# Altium project DIO_RJ45_DIOT.PrjPCB (part 1 of 3)
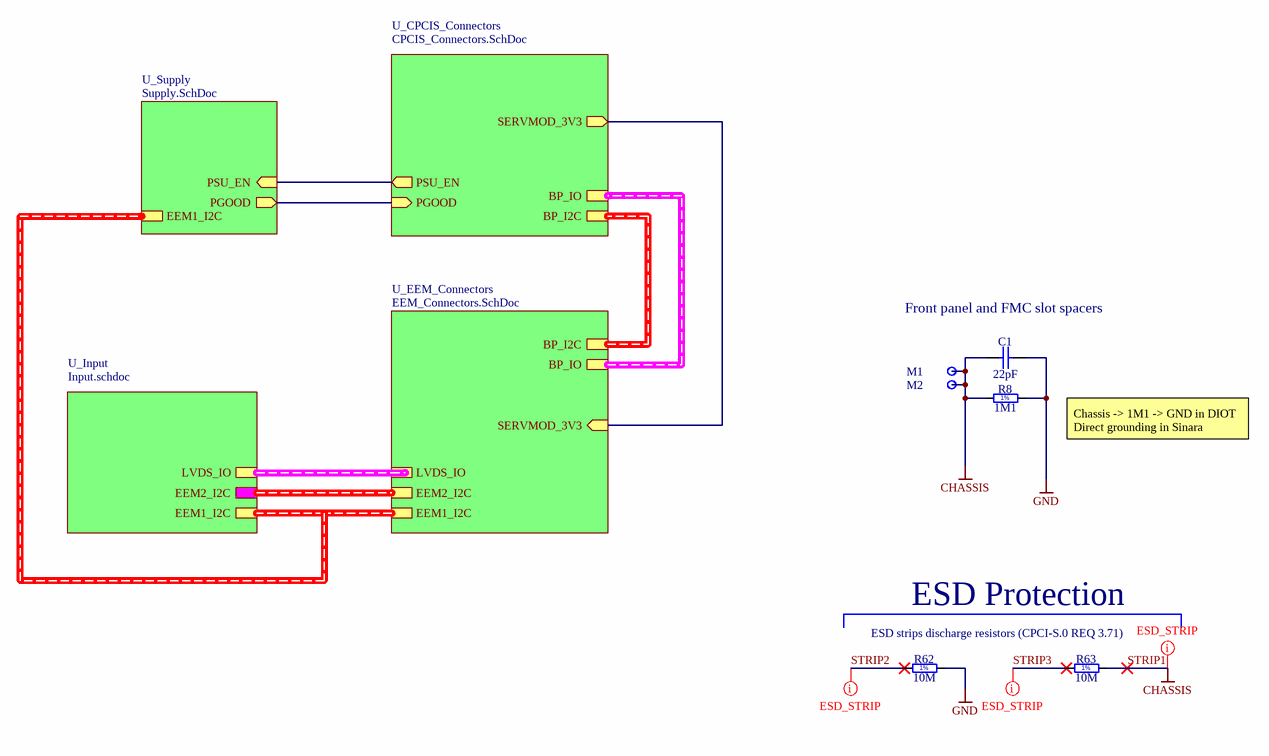
[diagram p0: DIO45_TOP.SchDoc]
Address1: Warsaw Uniwersity of Technology; Address2: Nowowiejska 15/19; Address3: ise@pw.edu.pl; Author: G.K.; CheckedDate: -; CompanyName: WUT; CreateDate: -; Designer: G.K.; DrawnBy: G.K.; ModifiedBy: M.Mroz; Organization: WUT ISE; ProjectName: DIO_RJ45_DIOT; Revision: 1.2; SheetTotal: 6; Title: DIO_RJ45_DIOT
6 sheets, 318 parts. Net scope: hierarchical (ports join the sheet entries above them; power ports are global).
Board file: DIO_RJ45_DIOT.PCBDOC
Sheets:
  DIO45_TOP.SchDoc
    U_CPCIS_Connectors = CPCIS_Connectors.SchDoc
    U_EEM_Connectors = EEM_Connectors.SchDoc
    U_Input = Input.schdoc
      U_LVDS_repeater = LVDS_repeater.SchDoc
      U_LVDS_repeater = LVDS_repeater.SchDoc
      U_LVDS_repeater = LVDS_repeater.SchDoc
      U_LVDS_repeater = LVDS_repeater.SchDoc
      U_LVDS_repeater = LVDS_repeater.SchDoc
      U_LVDS_repeater = LVDS_repeater.SchDoc
      U_LVDS_repeater = LVDS_repeater.SchDoc
      U_LVDS_repeater = LVDS_repeater.SchDoc
      U_LVDS_repeater = LVDS_repeater.SchDoc
      U_LVDS_repeater = LVDS_repeater.SchDoc
      U_LVDS_repeater = LVDS_repeater.SchDoc
      U_LVDS_repeater = LVDS_repeater.SchDoc
      U_LVDS_repeater = LVDS_repeater.SchDoc
      U_LVDS_repeater = LVDS_repeater.SchDoc
      U_LVDS_repeater = LVDS_repeater.SchDoc
      U_LVDS_repeater = LVDS_repeater.SchDoc
    U_Supply = Supply.SchDoc

## Sheet DIO45_TOP.SchDoc: DIO_RJ45_DIOT
size 297 x 209 mm; Revision: 0.1; SheetNumber: 1; SheetTotal: 5; Title2: DIO45_TOP

### Parts
C1  22pF  [CAPC1005X55N]
M1  Plated Hole  [MTG300_600]  (value not drawn)  (no BOM)
M2  Plated Hole  [MTG300_600]  (value not drawn)  (no BOM)
R8  1M1  [RESC2012X60N]
R62  10M  [RESC2113X55N]
R63  10M  [RESC2113X55N]

### Sub-sheets
U_CPCIS_Connectors = CPCIS_Connectors.SchDoc: BP_I2C (harness I2C), SERVMOD_3V3 (out), BP_IO (harness BP_IO), PSU_EN (out), PGOOD (in)
U_EEM_Connectors = EEM_Connectors.SchDoc: EEM1_I2C (harness I2C), EEM2_I2C (harness I2C), LVDS_IO (harness LVDS_IO), BP_IO (harness BP_IO), BP_I2C (harness I2C), SERVMOD_3V3 (in)
U_Input = Input.schdoc: EEM1_I2C (harness I2C), EEM2_I2C (harness I2C), LVDS_IO (harness LVDS_IO)
U_Supply = Supply.SchDoc: PSU_EN (in), PGOOD (out), EEM1_I2C (harness I2C)

### Nets
GND: C1.2 R8.2 R62.2
STRIP1: C1.1 M1.1 M2.1 R8.1 R63.2  [also labelled CHASSIS]
PGOOD: sheet U_CPCIS_Connectors/PGOOD, sheet U_Supply/PGOOD
PSU_EN: sheet U_CPCIS_Connectors/PSU_EN, sheet U_Supply/PSU_EN
SERVMOD_3V3: sheet U_CPCIS_Connectors/SERVMOD_3V3, sheet U_EEM_Connectors/SERVMOD_3V3
STRIP2: R62.1
STRIP3: R63.1

### Buses and harness runs
harness sheet U_CPCIS_Connectors/BP_I2C = sheet U_EEM_Connectors/BP_I2C
harness sheet U_CPCIS_Connectors/BP_IO = sheet U_EEM_Connectors/BP_IO
harness sheet U_EEM_Connectors/EEM1_I2C = sheet U_Input/EEM1_I2C = sheet U_Supply/EEM1_I2C
harness sheet U_EEM_Connectors/EEM2_I2C = sheet U_Input/EEM2_I2C
harness sheet U_EEM_Connectors/LVDS_IO = sheet U_Input/LVDS_IO

### Layout directives
net class ESD_STRIP: STRIP1, STRIP2, STRIP3

### Notes on the sheet
- Front panel and FMC slot spacers
- Chassis -> 1M1 -> GND in DIOT
  Direct grounding in Sinara
- ESD strips discharge resistors (CPCI-S.0 REQ 3.71)
- ESD Protection
- Project/Equipment
- Document
- Designer
- Drawn by
- Check.by
- Copyright WUT ISE 2024.
  This documentation describes Open Hardware and is licensed under the CERN OHL v.2. You may redistribute and modify this documentation under the terms of the CERN OHL v.2. (http://ohwr.org/CERNOHL). This documentation is distributed WITHOUT ANY EXPRESS OR IMPLIED WARRANTY, INCLUDING OF MERCHANTABILITY, SATISFACTORY QUALITY AND FITNESS FOR A PARTICULAR PURPOSE. Please see the CERN OHL v.2 for applicable conditions.
- Contact
- File
- Last Mod.
- Print Date
- Sheet
- Size
- A3
- of
- Rev
- (in symbol R0805_1M1_1%_0.125W_100PPM) 1%
- (in symbol R0805_10M_1%_0.125W_100PPM_VISHAY_CRCW e3) 1%

### Library data of the parts
C1 = CC0402_22PF_50V_5%_C0G: Non-polarised capacitor; Part Description: SMD Multilayer Chip Ceramic Capacitor; Manufacturer: GENERIC; Manufacturer1 Part Number: C0402C220J5GACTU; Voltage: 50V; TC: C0G/NP0; Tolerance: ±5%; Part Number: CC0402_22PF_50V_5%_C0G; Component Kind: Standard; Component Type: Standard; Pin Count: 2; Value: 22pF; Status: Preferred; Manufacturer Part Number: CC0402_22PF_50V_5%_C0G; Case: 0402; Mounted: Yes; Socket: No; SMD: Yes; Manufacturer1 Example: KEMET; Manufacturer1 ComponentHeight: 0.55mm; HelpURL: \\cern.ch\dfs\Applications\Altium\Datasheets\CC0402_C0G_KEMET_(Commercial Grade).pdf; Author: CERN DEM JLC; CreateDate: 2007-12-03; LatestRevisionDate: 2007-12-03; Sense: No
M1 M2 = PLATED_HOLE3.0_PAD6.0: Single Terminal Socket; Part Description: Plated Through Hole: Hole Dia.=3.0mm Pad Dia.=6.0mm; Mounted: No; Table: Pads; Part Number: PLATED_HOLE3.0_PAD6.0; Component Type: Standard (No BOM); Designator: Single Terminal Socket; Library Reference: Single Terminal Socket; Pin Count: 1; Family: Plated Hole; Socket: No; SMD: No; Status: None; ComponentHeight: 0mm; Author: CERN DEM JLC; CreateDate: 26.05.2008; LatestRevisionDate: 26.05.2008; PackageDescription: Plated Through Hole: Hole Dia.=3.0mm Pad Dia.=6.0mm
R8 = R0805_1M1_1%_0.125W_100PPM: Resistor - 1%; Part Description: General Purpose Thick Film Chip Resistor; Manufacturer: GENERIC; Manufacturer1 Part Number: NRC10F1104TRF; PressFit: No; Part Number: R0805_1M1_1%_0.125W_100PPM; Component Kind: Standard; Component Type: Standard; Pin Count: 2; Value: 1M1; Status: Preferred; Manufacturer Part Number: R0805_1M1_1%_0.125W_100PPM; Case: 0805; Mounted: Yes; Sense: No; Socket: No; SMD: Yes; Manufacturer1 Example: NIC COMPONENT; Manufacturer1 ComponentHeight: 0.6mm; HelpURL: \\cern.ch\dfs\Applications\Altium\Datasheets\R0805_NIC_NRC.pdf; Author: CERN DEM JLC; CreateDate: 03/12/2007; LatestRevisionDate: 13/03/2008
R62 R63 = R0805_10M_1%_0.125W_100PPM_VISHAY_CRCW e3: Resistor - 1%; Part Description: 150V, Standard Thick Film Chip Resistor; Manufacturer: VISHAY DALE; Manufacturer Part Number: CRCW080510M0FKEA; Power: 0.125W; TC: ±100ppm/°C; PressFit: No; Part Number: R0805_10M_1%_0.125W_100PPM_VISHAY_CRCW e3; Component Kind: Standard; Component Type: Standard; Pin Count: 2; Value: 10M; Status: None; Tolerance: ±1%; Case: 0805; Mounted: Yes; Sense: No; Socket: No; SMD: Yes; ComponentHeight: 0.5mm; HelpURL: \\cern.ch\dfs\Applications\Altium\Datasheets\R0805_VISHAY_CRCW e3.pdf; Author: CERN DEM BC; CreateDate: 2019-11-12; LatestRevisionDate: 2019-11-12

## Sheet CPCIS_Connectors.SchDoc: DIO_RJ45_DIOT
size 420 x 297 mm; SheetNumber: 3; SPICEModelCacheWWJYHNFZ: <root> / <DocumentId>WWJYHNFZ</DocumentId> / </root>; Title2: CPCIS_Connectors
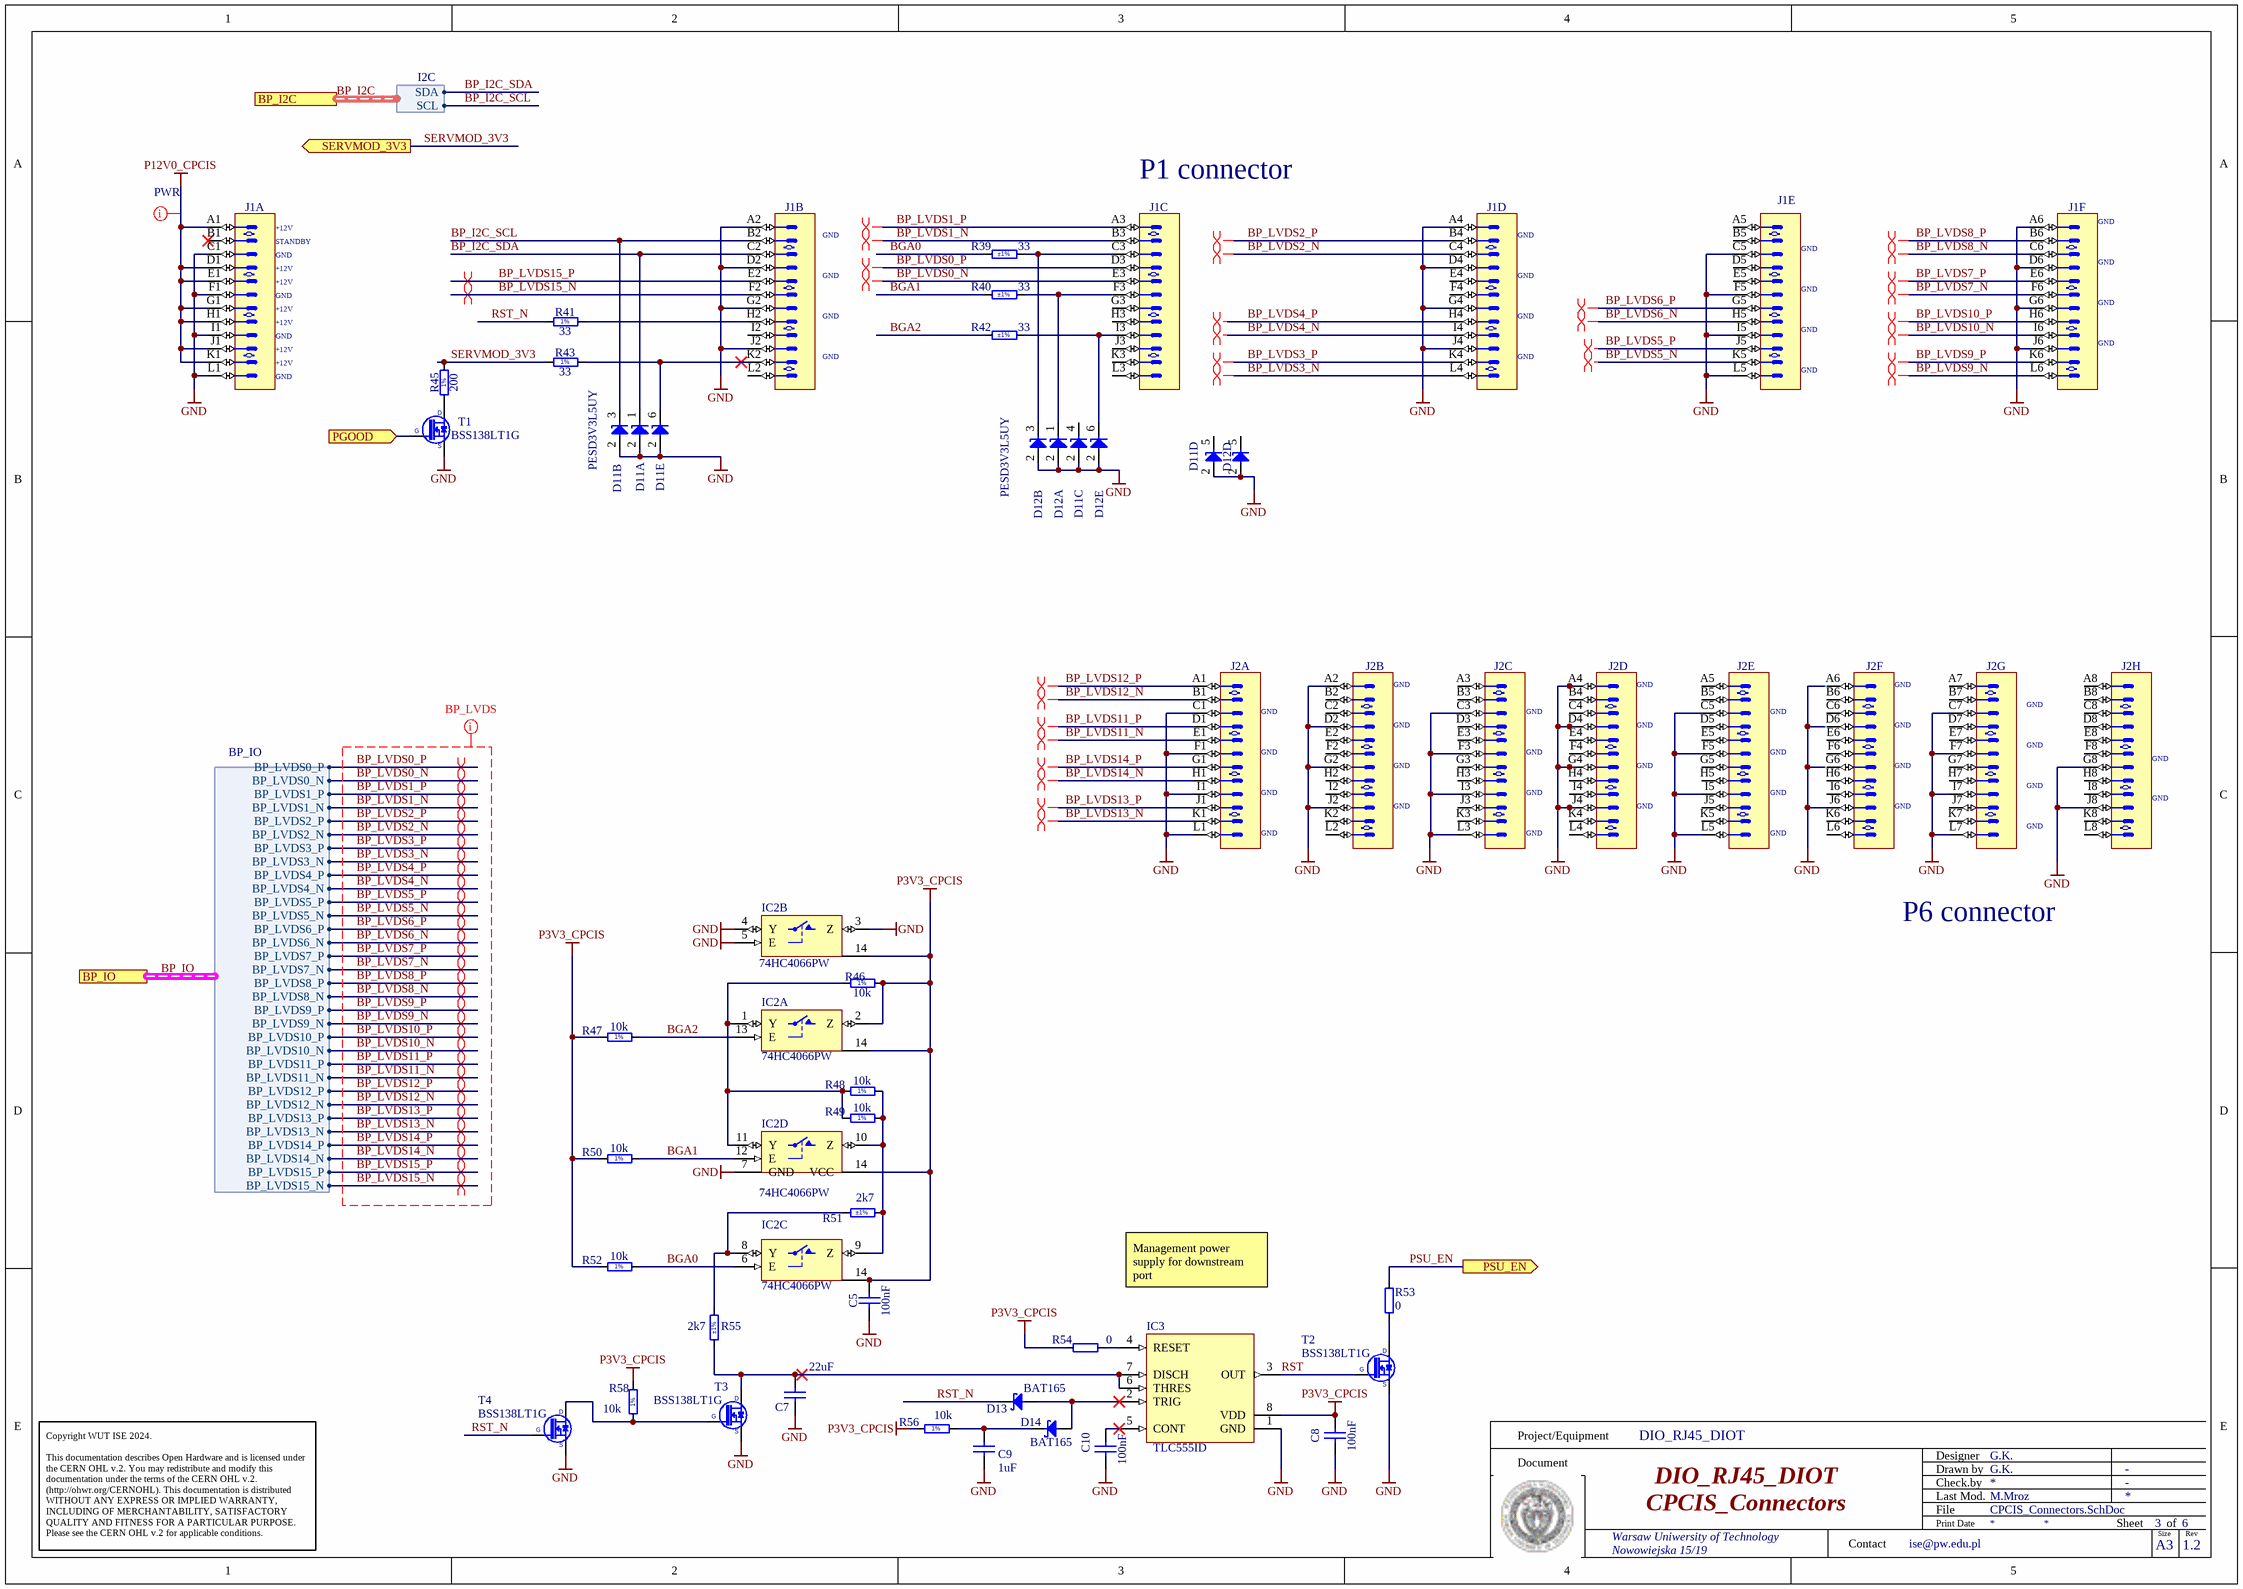
[diagram p1: CPCIS_Connectors.SchDoc]

### Parts
C5  100nF  [CAPC1005X55N]
C7  22uF  [CAPC2012X135N]
C8  100nF  [CAPC1005X55N]
C9  1uF  [CAPC1608X87N]
C10  100nF  [CAPC1005X55N]
D11  PESD3V3L5UY  [SOT65P210X110-6N]  (value not drawn)  (parts A,B,C,D,E of 5)
D12  PESD3V3L5UY  [SOT65P210X110-6N]  (value not drawn)  (parts A,B,D,E of 5)
D13  BAT165  [SOD2512X110N]
D14  BAT165  [SOD2512X110N]
IC2  74HC4066PW  [SOP65P640X110-14N]  (parts A,B,C,D of 4)
IC3  TLC555ID  [SOIC127P600X175-8N]
J1  (no value)  [AMPHENOL_10052825-101LF]  (parts A,B,C,D,E,F of 6)
J2  (no value)  [AMPHENOL_10052838-101LF]  (parts A,B,C,D,E,F,G,H of 8)
R39  33  Tolerance: ±1%  [RESC1608X55N]
R40  33  Tolerance: ±1%  [RESC1608X55N]
R41  33  Tolerance: 1%  [RESC1005X40N]
R42  33  Tolerance: ±1%  [RESC1608X55N]
R43  33  Tolerance: 1%  [RESC1005X40N]
R45  200  [RESC1005X40N]
R46  10k  [RESC1005X40N]
R47  10k  [RESC1005X40N]
R48  10k  [RESC1005X40N]
R49  10k  [RESC1005X40N]
R50  10k  [RESC1005X40N]
R51  2k7  Tolerance: ±1%  [RESC1608X55N]
R52  10k  [RESC1005X40N]
R53  0  [RESC1005X35N]
R54  0  [RESC1005X35N]
R55  2k7  Tolerance: ±1%  [RESC1608X55N]
R56  10k  [RESC1005X40N]
R58  10k  [RESC1005X40N]
T1  BSS138LT1G  [SOT95P240X110-3N]
T2  BSS138LT1G  [SOT95P240X110-3N]
T3  BSS138LT1G  [SOT95P240X110-3N]
T4  BSS138LT1G  [SOT95P240X110-3N]

### Ports
BP_I2C (harness I2C), BP_IO (harness BP_IO), PGOOD (in), PSU_EN (out), SERVMOD_3V3 (out)

### Harnesses
I2C: SDA, SCL
BP_IO: BP_LVDS0_P, BP_LVDS0_N, BP_LVDS1_P, BP_LVDS1_N, BP_LVDS2_P, BP_LVDS2_N, BP_LVDS3_P, BP_LVDS3_N, BP_LVDS4_P, BP_LVDS4_N, BP_LVDS5_P, BP_LVDS5_N, BP_LVDS6_P, BP_LVDS6_N, BP_LVDS7_P, BP_LVDS7_N, BP_LVDS8_P, BP_LVDS8_N, BP_LVDS9_P, BP_LVDS9_N, BP_LVDS10_P, BP_LVDS10_N, BP_LVDS11_P, BP_LVDS11_N, BP_LVDS12_P, BP_LVDS12_N, BP_LVDS13_P, BP_LVDS13_N, BP_LVDS14_P, BP_LVDS14_N, BP_LVDS15_P, BP_LVDS15_N

### Nets
GND: C5.1 C7.1 C8.1 C9.1 C10.1 D11.2(A) D12.2(A) IC2.3(Z) IC2.4(Y) IC2.5(E) IC2.7(GND) IC3.1(GND) J1.A2 J1.A4 J1.A6 J1.C1 J1.C5 J1.D2 J1.D4 J1.D6 J1.F1 J1.F5 J1.G2 J1.G4 J1.G6 J1.I1 J1.I5 J1.J2 J1.J4 J1.J6 J1.L1 J1.L5 J2.A2 J2.A4 J2.C1 J2.C3 J2.C5 J2.C7 J2.D2 J2.D4 J2.F1 J2.F3 J2.F5 J2.F7 J2.G2 J2.G4 J2.G8 J2.I1 J2.I3 J2.I5 J2.I7 J2.J2 J2.J4 J2.J6 J2.J8 J2.L1 J2.L3 J2.L5 J2.L7 T1.2(S) T2.2(S) T3.2(S) T4.2(S)
P3V3_CPCIS: C5.2 C8.2 IC2.2(Z) IC2.14(VCC) IC3.8(VDD) R46.2 R47.1 R50.1 R52.1 R54.2 R56.1 R58.2
P12V0_CPCIS: J1.A1 J1.D1 J1.E1 J1.G1 J1.H1 J1.J1 J1.K1
BGA0: IC2.6(E) R39.2 R52.2
BGA1: IC2.12(E) R40.2 R50.2
BGA2: IC2.13(E) R42.2 R47.2
BP_I2C_SCL: D11.3(C) J1.B2 ; port BP_I2C.SCL  [project net BP_I2C.SCL]
BP_I2C_SDA: D11.1(C) J1.C2 ; port BP_I2C.SDA  [project net BP_I2C.SDA]
BP_LVDS0_N: J1.E3 ; port BP_IO.BP_LVDS0_N  [project net BP_IO.BP_LVDS0_N]
BP_LVDS0_P: J1.D3 ; port BP_IO.BP_LVDS0_P  [project net BP_IO.BP_LVDS0_P]
BP_LVDS1_N: J1.B3 ; port BP_IO.BP_LVDS1_N  [project net BP_IO.BP_LVDS1_N]
BP_LVDS1_P: J1.A3 ; port BP_IO.BP_LVDS1_P  [project net BP_IO.BP_LVDS1_P]
BP_LVDS2_N: J1.C4 ; port BP_IO.BP_LVDS2_N  [project net BP_IO.BP_LVDS2_N]
BP_LVDS2_P: J1.B4 ; port BP_IO.BP_LVDS2_P  [project net BP_IO.BP_LVDS2_P]
BP_LVDS3_N: J1.L4 ; port BP_IO.BP_LVDS3_N  [project net BP_IO.BP_LVDS3_N]
BP_LVDS3_P: J1.K4 ; port BP_IO.BP_LVDS3_P  [project net BP_IO.BP_LVDS3_P]
BP_LVDS4_N: J1.I4 ; port BP_IO.BP_LVDS4_N  [project net BP_IO.BP_LVDS4_N]
BP_LVDS4_P: J1.H4 ; port BP_IO.BP_LVDS4_P  [project net BP_IO.BP_LVDS4_P]
BP_LVDS5_N: J1.K5 ; port BP_IO.BP_LVDS5_N  [project net BP_IO.BP_LVDS5_N]
BP_LVDS5_P: J1.J5 ; port BP_IO.BP_LVDS5_P  [project net BP_IO.BP_LVDS5_P]
BP_LVDS6_N: J1.H5 ; port BP_IO.BP_LVDS6_N  [project net BP_IO.BP_LVDS6_N]
BP_LVDS6_P: J1.G5 ; port BP_IO.BP_LVDS6_P  [project net BP_IO.BP_LVDS6_P]
BP_LVDS7_N: J1.F6 ; port BP_IO.BP_LVDS7_N  [project net BP_IO.BP_LVDS7_N]
BP_LVDS7_P: J1.E6 ; port BP_IO.BP_LVDS7_P  [project net BP_IO.BP_LVDS7_P]
BP_LVDS8_N: J1.C6 ; port BP_IO.BP_LVDS8_N  [project net BP_IO.BP_LVDS8_N]
BP_LVDS8_P: J1.B6 ; port BP_IO.BP_LVDS8_P  [project net BP_IO.BP_LVDS8_P]
BP_LVDS9_N: J1.L6 ; port BP_IO.BP_LVDS9_N  [project net BP_IO.BP_LVDS9_N]
BP_LVDS9_P: J1.K6 ; port BP_IO.BP_LVDS9_P  [project net BP_IO.BP_LVDS9_P]
BP_LVDS10_N: J1.I6 ; port BP_IO.BP_LVDS10_N  [project net BP_IO.BP_LVDS10_N]
BP_LVDS10_P: J1.H6 ; port BP_IO.BP_LVDS10_P  [project net BP_IO.BP_LVDS10_P]
BP_LVDS11_N: J2.E1 ; port BP_IO.BP_LVDS11_N  [project net BP_IO.BP_LVDS11_N]
BP_LVDS11_P: J2.D1 ; port BP_IO.BP_LVDS11_P  [project net BP_IO.BP_LVDS11_P]
BP_LVDS12_N: J2.B1 ; port BP_IO.BP_LVDS12_N  [project net BP_IO.BP_LVDS12_N]
BP_LVDS12_P: J2.A1 ; port BP_IO.BP_LVDS12_P  [project net BP_IO.BP_LVDS12_P]
BP_LVDS13_N: J2.K1 ; port BP_IO.BP_LVDS13_N  [project net BP_IO.BP_LVDS13_N]
BP_LVDS13_P: J2.J1 ; port BP_IO.BP_LVDS13_P  [project net BP_IO.BP_LVDS13_P]
BP_LVDS14_N: J2.H1 ; port BP_IO.BP_LVDS14_N  [project net BP_IO.BP_LVDS14_N]
BP_LVDS14_P: J2.G1 ; port BP_IO.BP_LVDS14_P  [project net BP_IO.BP_LVDS14_P]
BP_LVDS15_N: J1.F2 ; port BP_IO.BP_LVDS15_N  [project net BP_IO.BP_LVDS15_N]
BP_LVDS15_P: J1.E2 ; port BP_IO.BP_LVDS15_P  [project net BP_IO.BP_LVDS15_P]
PGOOD: T1.1(G) ; port PGOOD
PSU_EN: R53.1 ; port PSU_EN
RST: IC3.3(OUT) T2.1(G)
RST_N: D13.1(C) R41.1 T4.1(G)
SERVMOD_3V3: R43.1 R45.2 ; port SERVMOD_3V3
NetC7_2: C7.2 IC3.6(THRES) IC3.7(DISCH) R55.2 T3.3(D)
NetC9_2: C9.2 D14.1(C) R56.2
NetC10_2: C10.2 IC3.5(CONT)
NetD11_6: D11.6(C) J1.K2 R43.2
NetD12_1: D12.1(C) J1.F3 R40.1
NetD12_3: D12.3(C) J1.C3 R39.1
NetD12_6: D12.6(C) J1.I3 R42.1
NetD13_2: D13.2(A) D14.2(A) IC3.2(TRIG)
NetIC2_1: IC2.1(Y) IC2.11(Y) R46.1 R48.1 R49.1
NetIC2_8: IC2.8(Y) R51.1 R55.1
NetIC2_9: IC2.9(Z) IC2.10(Z) R48.2 R49.2 R51.2
NetIC3_4: IC3.4(RESET) R54.1
NetJ1_H2: J1.H2 R41.2
NetR45_1: R45.1 T1.3(D)
NetR53_2: R53.2 T2.3(D)
NetR58_1: R58.1 T3.1(G) T4.3(D)

Not connected (* = marked no-connect by the designer): D11 4(C) 5(C); D12 5(C); J1 A5 B1* B5 D5 E4 E5 F4 G3 H3 I2 J3 K3 L2 L3; J2 A3 A5 A6 A7 A8 B2 B3 B4 B5 B6 B7 B8 C2 C4 C6 C8 D3 D5 D6 D7 D8 E2 E3 E4 E5 E6 E7 E8 F2 F4 F6 F8 G3 G5 G6 G7 H2 H3 H4 H5 H6 H7 H8 I2 I4 I6 I8 J3 J5 J7 K2 K3 K4 K5 K6 K7 K8 L2 L4 L6 L8

### Buses and harness runs
harness BP_I2C = port BP_I2C
harness BP_IO = port BP_IO

### Layout directives
net class PWR: P12V0_CPCIS
differential pair: BP_IO.BP_LVDS0_N, BP_IO.BP_LVDS0_P, BP_IO.BP_LVDS1_N, BP_IO.BP_LVDS1_P, BP_IO.BP_LVDS2_N, BP_IO.BP_LVDS2_P, BP_IO.BP_LVDS3_N, BP_IO.BP_LVDS3_P, BP_IO.BP_LVDS4_N, BP_IO.BP_LVDS4_P, BP_IO.BP_LVDS5_N, BP_IO.BP_LVDS5_P, BP_IO.BP_LVDS6_N, BP_IO.BP_LVDS6_P, BP_IO.BP_LVDS7_N, BP_IO.BP_LVDS7_P, BP_IO.BP_LVDS8_N, BP_IO.BP_LVDS8_P, BP_IO.BP_LVDS9_N, BP_IO.BP_LVDS9_P, BP_IO.BP_LVDS10_N, BP_IO.BP_LVDS10_P, BP_IO.BP_LVDS11_N, BP_IO.BP_LVDS11_P, BP_IO.BP_LVDS12_N, BP_IO.BP_LVDS12_P, BP_IO.BP_LVDS13_N, BP_IO.BP_LVDS13_P, BP_IO.BP_LVDS14_N, BP_IO.BP_LVDS14_P, BP_IO.BP_LVDS15_N, BP_IO.BP_LVDS15_P
net class BP_LVDS: BP_LVDS0_N, BP_LVDS0_P, BP_LVDS1_N, BP_LVDS1_P, BP_LVDS2_N, BP_LVDS2_P, BP_LVDS3_N, BP_LVDS3_P, BP_LVDS4_N, BP_LVDS4_P, BP_LVDS5_N, BP_LVDS5_P, BP_LVDS6_N, BP_LVDS6_P, BP_LVDS7_N, BP_LVDS7_P, BP_LVDS8_N, BP_LVDS8_P, BP_LVDS9_N, BP_LVDS9_P, BP_LVDS10_N, BP_LVDS10_P, BP_LVDS11_N, BP_LVDS11_P, BP_LVDS12_N, BP_LVDS12_P, BP_LVDS13_N, BP_LVDS13_P, BP_LVDS14_N, BP_LVDS14_P, BP_LVDS15_N, BP_LVDS15_P

### Notes on the sheet
- (near J1) P1 connector
- (near J1) +12V
- (near J1) STANDBY
- (near J1) GND
- (near J2) GND
- P6 connector
- Management power supply for downstream port
- Project/Equipment
- Document
- Designer
- Drawn by
- Check.by
- Copyright WUT ISE 2024.
  This documentation describes Open Hardware and is licensed under the CERN OHL v.2. You may redistribute and modify this documentation under the terms of the CERN OHL v.2. (http://ohwr.org/CERNOHL). This documentation is distributed WITHOUT ANY EXPRESS OR IMPLIED WARRANTY, INCLUDING OF MERCHANTABILITY, SATISFACTORY QUALITY AND FITNESS FOR A PARTICULAR PURPOSE. Please see the CERN OHL v.2 for applicable conditions.
- Contact
- File
- Last Mod.
- Print Date
- Sheet
- Size
- A3
- of
- Rev
- (in symbol R0402_10K_1%_0.0625W_100PPM) 1%
- (in symbol R0402_200R_1%_0.0625W_100PPM) 1%

### Library data of the parts
C5 C8 C10 = CC0402_100NF_16V_10%_X5R: Non-polarised capacitor; Part Description: SMD Multilayer Chip Ceramic Capacitor; Manufacturer: GENERIC; Manufacturer1 Part Number: GRM155R61C104KA88D; Voltage: 16V; TC: X5R; Tolerance: ±10%; Part Number: CC0402_100NF_16V_10%_X5R; Component Kind: Standard; Component Type: Standard; Pin Count: 2; Value: 100nF; Status: None; Manufacturer Part Number: CC0402_100NF_16V_10%_X5R; Case: 0402; Mounted: Yes; Socket: No; SMD: Yes; Sense: No; Manufacturer1 Example: MURATA; Manufacturer1 ComponentHeight: 0.55mm; HelpURL: \\cern.ch\dfs\Applications\Altium\Datasheets\CC0402_X5R_MURATA_GRM.pdf; Author: CERN DEM JLC; CreateDate: 10.12.2013; LatestRevisionDate: 10.12.2013
C7 = CC0805_22UF_16V_10%_X5R: Non-polarised capacitor; Part Description: SMD Multilayer Chip Ceramic Capacitor; Manufacturer: GENERIC; Manufacturer1 Part Number: C2012X5R1C226KT; Voltage: 16V; TC: X5R; Tolerance: ±10%; Part Number: CC0805_22UF_16V_10%_X5R; Component Kind: Standard; Component Type: Standard; Pin Count: 2; Value: 22uF; Status: Preferred; Manufacturer Part Number: CC0805_22UF_16V_10%_X5R; Case: 0805; Mounted: Yes; Socket: No; SMD: Yes; Sense: No; Manufacturer1 Example: TDK; Manufacturer1 ComponentHeight: 1.35mm; HelpURL: \\cern.ch\dfs\Applications\Altium\Datasheets\CC0805_X5R_TDK_C.pdf; Author: CERN DEM JLC; CreateDate: 25.10.2012; LatestRevisionDate: 25.10.2012
C9 = CC0603_1UF_16V_10%_X7R: Non-polarised capacitor; Part Description: SMD Multilayer Chip Ceramic Capacitor; Manufacturer: GENERIC; Manufacturer1 Part Number: 223878615663; Voltage: 16V; TC: X7R; Tolerance: ±10%; Part Number: CC0603_1UF_16V_10%_X7R; Component Kind: Standard; Component Type: Standard; Pin Count: 2; Value: 1uF; Status: None; Manufacturer Part Number: CC0603_1UF_16V_10%_X7R; Case: 0603; Mounted: Yes; Socket: No; SMD: Yes; Sense: No; Manufacturer1 Example: YAGEO PHYCOMP; Manufacturer1 ComponentHeight: 0.9mm; HelpURL: \\cern.ch\dfs\Applications\Altium\Datasheets\CC0603_X7R_PHYCOMP.pdf; Author: CERN DEM JLC; CreateDate: 03.12.2007; LatestRevisionDate: 17.04.2015
D11 D12 = PESD3V3L5UY: Fivefold ESD Protection Diode Arrays; Part Description: Fivefold ESD Protection Diode Arrays (30kV); Manufacturer: NEXPERIA; Voltage: 3.3V; Power: 200W; PressFit: No; Bonding: No; Part Number: PESD3V3L5UY; Component Kind: Standard; Component Type: Standard; Device: PESD3V3L5UY; PackageDescription: SOT363, SC-88, 0.65mm Pitch; 6 Pin, 1.25mm W X 2.00mm L X 1.10mm H body, IPC Medium Density; Manufacturer Part Number: PESD3V3L5UY; Pin Count: 6; Case: SOT363; Mounted: Yes; Socket: No; SMD: Yes; Sense: No; ComponentHeight: 1.1mm; HelpURL: \\cern.ch\dfs\Applications\Altium\Datasheets\PESD3V3L5UY.pdf; Author: CERN DEM WB; CreateDate: 05.07.2021; LatestRevisionDate: 05.07.2021
D13 D14 = BAT165: Schottky Diode; Manufacturer: INFINEON; Part Description: Medium Power AF Schottky Diode; Voltage: 40V; Power: 750mA; PressFit: No; Bonding: No; Manufacturer Part Number: BAT165; PackageDescription: Small Outline Diode (SOD-323), 1.70mm W X 1.25mm L X 1.10mm H body,  IPC Medium Density; Part Number: BAT165; Component Kind: Standard; Component Type: Standard; Device: BAT165; Pin Count: 2; Case: SOD323; Mounted: Yes; Socket: No; SMD: Yes; Sense: No; ComponentHeight: 1.1mm; HelpURL: \\cern.ch\dfs\Applications\Altium\Datasheets\BAT165.pdf; Author: CERN DEM JLC; CreateDate: 12.11.2014; LatestRevisionDate: 12.11.2014
IC2 = 74HC4066PW: Part Description: Quad Single-Pole Single-Throw Analog Switch; Manufacturer: NXP SEMICONDUCTORS; PressFit: No; Bonding: No; Table: Standard Logic; Part Number: 74HC4066PW; Component Kind: Standard; Component Type: Standard; Device: 74HC4066PW; PackageDescription: SOP, 14-Leads, Body 4.4x5mm (max), Pitch 0.65mm, IPC Medium Density; Manufacturer Part Number: 74HC4066PW; Pin Count: 14; Case: TSSOP14; Mounted: Yes; Socket: No; SMD: Yes; ComponentHeight: 1.1mm; Author: CERN DEM JLC; HelpURL: \\cern.ch\dfs\Applications\Altium\Datasheets\74HC4066PW.pdf; CreateDate: 2014-11-19; LatestRevisionDate: 2014-11-19
IC3 = TLC555ID: LinCMOS Timer; Manufacturer: TEXAS INSTRUMENTS; PressFit: No; Bonding: No; Part Number: TLC555ID; Component Kind: Standard; Component Type: Standard; Device: TLC555ID; PackageDescription: SOIC 8, Pitch 1.27mm, Body 4x5mm, IPC Medium Density; Part Description: LinCMOS Timer; Manufacturer Part Number: TLC555ID; Pin Count: 8; Case: SOIC8; Mounted: Yes; Socket: No; SMD: Yes; Sense: No; ComponentHeight: 1.75mm; Author: CERN DEM JMW; HelpURL: \\cern.ch\dfs\Applications\Altium\Datasheets\TLC555ID.pdf; CreateDate: 23.08.2016; LatestRevisionDate: 23.08.2016
J1 = AMPHENOL_10052825-101LF: 72 Contacts Header, 6 Columns, 4 Pairs per Column
J2 = AMPHENOL_10052838-101LF: 96 Contacts Header, 8 Columns, 4 Pairs per Column
R39 R40 R42 = R0603_33R_1%_0.1W_100PPM: Resistor - 1%; Part Description: General Purpose Thick Film Chip Resistor; Manufacturer: GENERIC; Manufacturer1 Part Number: NRC06F33R0TRF; Power: 0.1W; TC: ±100ppm/°C; PressFit: No; Part Number: R0603_33R_1%_0.1W_100PPM; Component Kind: Standard; Component Type: Standard; Pin Count: 2; Value: 33; Status: Preferred; Manufacturer Part Number: R0603_33R_1%_0.1W_100PPM; Case: 0603; Mounted: Yes; Sense: No; Socket: No; SMD: Yes; Manufacturer1 Example: NIC COMPONENT; Manufacturer1 ComponentHeight: 0.55mm; HelpURL: \\cern.ch\dfs\Applications\Altium\Datasheets\R0603_NIC_NRC.pdf; Author: CERN DEM JLC; CreateDate: 03.12.2007; LatestRevisionDate: 13.03.2008
R41 R43 = Resistor - 1%
R45 = R0402_200R_1%_0.0625W_100PPM: Resistor - 1%; Part Description: General Purpose Thick Film Chip Resistor; Manufacturer: GENERIC; Manufacturer1 Part Number: 232270672001L; TC: ±100ppm/°C; PressFit: No; Part Number: R0402_200R_1%_0.0625W_100PPM; Component Kind: Standard; Component Type: Standard; Pin Count: 2; Value: 200; Status: Not Recommended; Power: 0.0625W; Tolerance: ±1%; Manufacturer Part Number: R0402_200R_1%_0.0625W_100PPM; Case: 0402; Mounted: Yes; Sense: No; Socket: No; SMD: Yes; Manufacturer1 Example: YAGEO PHYCOMP; Manufacturer1 ComponentHeight: 0.4mm; HelpURL: \\cern.ch\dfs\Applications\Altium\Datasheets\R0402_Phycomp_RC0402.pdf; Author: CERN DEM JLC; CreateDate: 2007-12-03; LatestRevisionDate: 2012-10-17
R46-R50 R52 R56 R58 = R0402_10K_1%_0.0625W_100PPM: Resistor - 1%; Part Description: General Purpose Thick Film Chip Resistor; Manufacturer: GENERIC; Manufacturer1 Part Number: 232270671003L; TC: ±100ppm/°C; Part Number: R0402_10K_1%_0.0625W_100PPM; Component Kind: Standard; Component Type: Standard; Pin Count: 2; Value: 10k; Status: Not recommended; Power: 0.0625W; Tolerance: ±1%; Manufacturer Part Number: R0402_10K_1%_0.0625W_100PPM; Case: 0402; Mounted: Yes; Sense: No; Socket: No; SMD: Yes; Manufacturer1 Example: YAGEO PHYCOMP; Manufacturer1 ComponentHeight: 0.4mm; HelpURL: \\cern.ch\dfs\Applications\Altium\Datasheets\R0402_Phycomp_RC0402.pdf; Author: CERN DEM JLC; CreateDate: 03.12.2007; LatestRevisionDate: 17.10.2012
R51 R55 = R0603_2K7_1%_0.1W_100PPM: Resistor - 1%; Part Description: General Purpose Thick Film Chip Resistor; Manufacturer: GENERIC; Manufacturer1 Part Number: RC0603FR-072K7L; Power: 0.1W; TC: ±100ppm/°C; PressFit: No; Part Number: R0603_2K7_1%_0.1W_100PPM; Component Kind: Standard; Component Type: Standard; Pin Count: 2; Value: 2k7; Status: Preferred; Manufacturer Part Number: R0603_2K7_1%_0.1W_100PPM; Case: 0603; Mounted: Yes; Sense: No; Socket: No; SMD: Yes; Manufacturer1 Example: YAGEO PHYCOMP; Manufacturer1 ComponentHeight: 0.55mm; HelpURL: \\cern.ch\dfs\Applications\Altium\Datasheets\R0603_PHYCOMP_RC0603.pdf; Author: CERN DEM JLC; CreateDate: 02.05.2011; LatestRevisionDate: 02.05.2011
R53 R54 = R0402_0R_JUMPER: Resistor; Part Description: 1A (0.05R Max DC Resistance) Zero Ohm Jumper; Manufacturer: GENERIC; Manufacturer1 Part Number: 232270591001L; Part Number: R0402_0R_JUMPER; Component Kind: Standard; Component Type: Standard; Footprint: RESC1005X40N; Pin Count: 2; Value: 0; Status: Not recommended; Manufacturer Part Number: R0402_0R_JUMPER; Case: 0402; Mounted: Yes; Sense: No; Socket: No; SMD: Yes; Manufacturer1 Example: YAGEO PHYCOMP; Manufacturer1 ComponentHeight: 0.4mm; HelpURL: \\cern.ch\dfs\Applications\Altium\Datasheets\R0402_Phycomp_RC0402.pdf; Author: CERN DEM JLC; CreateDate: 03.12.2007; LatestRevisionDate: 17.10.2012
T1-T4 = BSS138LT1G: N-CHANNEL MOSFET WITH DIODE; Part Description: 50V, 200mA N-Channel Enhancement Mode Field-Effect Transistor; Manufacturer: ON SEMICONDUCTOR; PressFit: No; Bonding: No; Part Number: BSS138LT1G; Component Kind: Standard; Component Type: Standard; Device: BSS138LT1G; PackageDescription: SOT23, 0.95mm Pitch; 3 Pin, 1.40mm W X 3.00mm L X 1.10mm H body, IPC Medium Density; Manufacturer Part Number: BSS138L; Pin Count: 3; Case: SOT23-3; Mounted: Yes; Socket: No; SMD: Yes; Sense: No; ComponentHeight: 1.11mm; HelpURL: \\cern.ch\dfs\Applications\Altium\Datasheets\BSS138LT1G.pdf; Author: CERN DEM JLC; CreateDate: 23.03.2009; LatestRevisionDate: 25.05.2022

## Sheet EEM_Connectors.SchDoc: DIO_RJ45_DIOT
size 420 x 297 mm; SheetNumber: 2; Title2: EEM_Connectors
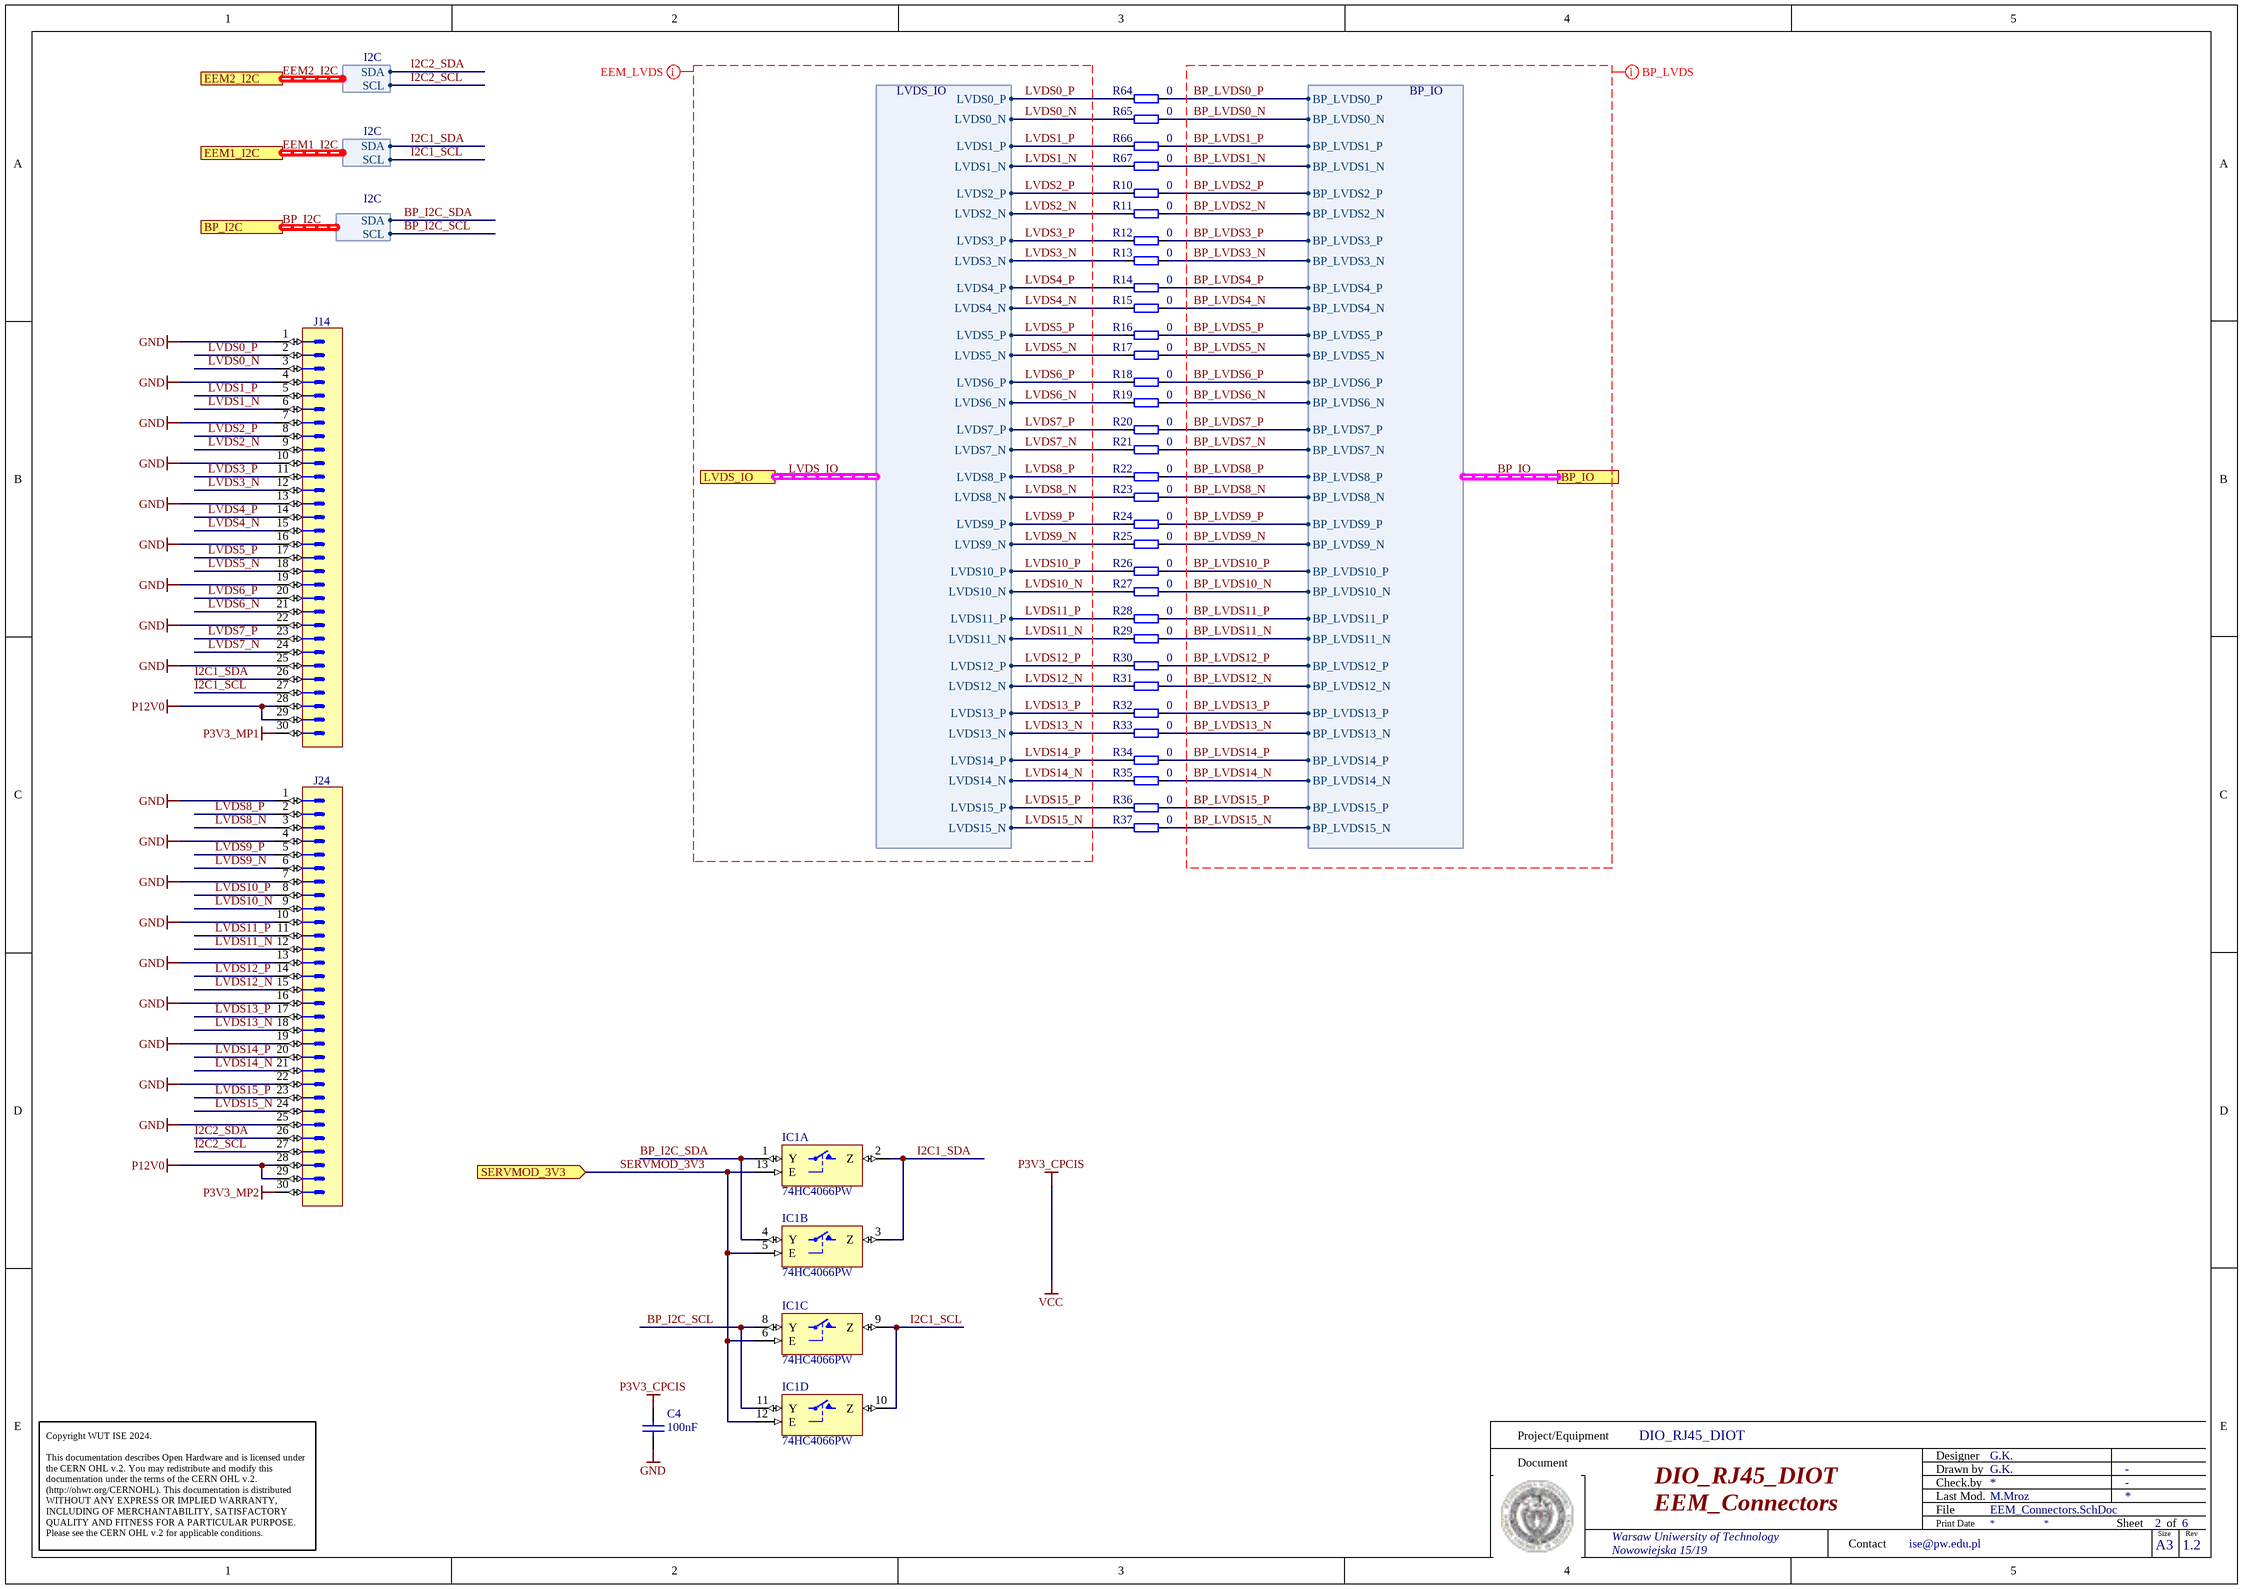
[diagram p2: EEM_Connectors.SchDoc]

### Parts
C4  100nF  [CAPC1608X87N]
IC1  74HC4066PW  [SOP65P640X110-14N]  (parts A,B,C,D of 4)
J14  (no value)  [3M_N2530-6002RB]
J24  (no value)  [3M_N2530-6002RB]
R10  0  [RESC1005X35N]
R11  0  [RESC1005X35N]
R12  0  [RESC1005X35N]
R13  0  [RESC1005X35N]
R14  0  [RESC1005X35N]
R15  0  [RESC1005X35N]
R16  0  [RESC1005X35N]
R17  0  [RESC1005X35N]
R18  0  [RESC1005X35N]
R19  0  [RESC1005X35N]
R20  0  [RESC1005X35N]
R21  0  [RESC1005X35N]
R22  0  [RESC1005X35N]
R23  0  [RESC1005X35N]
R24  0  [RESC1005X35N]
R25  0  [RESC1005X35N]
R26  0  [RESC1005X35N]
R27  0  [RESC1005X35N]
R28  0  [RESC1005X35N]
R29  0  [RESC1005X35N]
R30  0  [RESC1005X35N]
R31  0  [RESC1005X35N]
R32  0  [RESC1005X35N]
R33  0  [RESC1005X35N]
R34  0  [RESC1005X35N]
R35  0  [RESC1005X35N]
R36  0  [RESC1005X35N]
R37  0  [RESC1005X35N]
R64  0  [RESC1005X35N]
R65  0  [RESC1005X35N]
R66  0  [RESC1005X35N]
R67  0  [RESC1005X35N]

### Ports
BP_I2C (harness I2C), BP_IO (harness BP_IO), EEM1_I2C (harness I2C), EEM2_I2C (harness I2C), LVDS_IO (harness LVDS_IO), SERVMOD_3V3 (in)

### Harnesses
I2C: SDA, SCL
LVDS_IO: LVDS0_P, LVDS0_N, LVDS1_P, LVDS1_N, LVDS2_P, LVDS2_N, LVDS3_P, LVDS3_N, LVDS4_P, LVDS4_N, LVDS5_P, LVDS5_N, LVDS6_P, LVDS6_N, LVDS7_P, LVDS7_N, LVDS8_P, LVDS8_N, LVDS9_P, LVDS9_N, LVDS10_P, LVDS10_N, LVDS11_P, LVDS11_N, LVDS12_P, LVDS12_N, LVDS13_P, LVDS13_N, LVDS14_P, LVDS14_N, LVDS15_P, LVDS15_N
BP_IO: BP_LVDS0_P, BP_LVDS0_N, BP_LVDS1_P, BP_LVDS1_N, BP_LVDS2_P, BP_LVDS2_N, BP_LVDS3_P, BP_LVDS3_N, BP_LVDS4_P, BP_LVDS4_N, BP_LVDS5_P, BP_LVDS5_N, BP_LVDS6_P, BP_LVDS6_N, BP_LVDS7_P, BP_LVDS7_N, BP_LVDS8_P, BP_LVDS8_N, BP_LVDS9_P, BP_LVDS9_N, BP_LVDS10_P, BP_LVDS10_N, BP_LVDS11_P, BP_LVDS11_N, BP_LVDS12_P, BP_LVDS12_N, BP_LVDS13_P, BP_LVDS13_N, BP_LVDS14_P, BP_LVDS14_N, BP_LVDS15_P, BP_LVDS15_N

### Nets
GND: C4.1 IC1.7(GND) J14.1 J14.4 J14.7 J14.10 J14.13 J14.16 J14.19 J14.22 J14.25 J24.1 J24.4 J24.7 J24.10 J24.13 J24.16 J24.19 J24.22 J24.25
P3V3_CPCIS: C4.2 IC1.14(VCC)  [also labelled VCC]
P3V3_MP1: J14.30
P3V3_MP2: J24.30
P12V0: J14.28 J14.29 J24.28 J24.29
BP_I2C_SCL: IC1.8(Y) IC1.11(Y) ; port BP_I2C.SCL  [project net BP_I2C.SCL]
BP_I2C_SDA: IC1.1(Y) IC1.4(Y) ; port BP_I2C.SDA  [project net BP_I2C.SDA]
BP_LVDS0_N: R65.1 ; port BP_IO.BP_LVDS0_N  [project net BP_IO.BP_LVDS0_N]
BP_LVDS0_P: R64.1 ; port BP_IO.BP_LVDS0_P  [project net BP_IO.BP_LVDS0_P]
BP_LVDS1_N: R67.1 ; port BP_IO.BP_LVDS1_N  [project net BP_IO.BP_LVDS1_N]
BP_LVDS1_P: R66.1 ; port BP_IO.BP_LVDS1_P  [project net BP_IO.BP_LVDS1_P]
BP_LVDS2_N: R11.1 ; port BP_IO.BP_LVDS2_N  [project net BP_IO.BP_LVDS2_N]
BP_LVDS2_P: R10.1 ; port BP_IO.BP_LVDS2_P  [project net BP_IO.BP_LVDS2_P]
BP_LVDS3_N: R13.1 ; port BP_IO.BP_LVDS3_N  [project net BP_IO.BP_LVDS3_N]
BP_LVDS3_P: R12.1 ; port BP_IO.BP_LVDS3_P  [project net BP_IO.BP_LVDS3_P]
BP_LVDS4_N: R15.1 ; port BP_IO.BP_LVDS4_N  [project net BP_IO.BP_LVDS4_N]
BP_LVDS4_P: R14.1 ; port BP_IO.BP_LVDS4_P  [project net BP_IO.BP_LVDS4_P]
BP_LVDS5_N: R17.1 ; port BP_IO.BP_LVDS5_N  [project net BP_IO.BP_LVDS5_N]
BP_LVDS5_P: R16.1 ; port BP_IO.BP_LVDS5_P  [project net BP_IO.BP_LVDS5_P]
BP_LVDS6_N: R19.1 ; port BP_IO.BP_LVDS6_N  [project net BP_IO.BP_LVDS6_N]
BP_LVDS6_P: R18.1 ; port BP_IO.BP_LVDS6_P  [project net BP_IO.BP_LVDS6_P]
BP_LVDS7_N: R21.1 ; port BP_IO.BP_LVDS7_N  [project net BP_IO.BP_LVDS7_N]
BP_LVDS7_P: R20.1 ; port BP_IO.BP_LVDS7_P  [project net BP_IO.BP_LVDS7_P]
BP_LVDS8_N: R23.1 ; port BP_IO.BP_LVDS8_N  [project net BP_IO.BP_LVDS8_N]
BP_LVDS8_P: R22.1 ; port BP_IO.BP_LVDS8_P  [project net BP_IO.BP_LVDS8_P]
BP_LVDS9_N: R25.1 ; port BP_IO.BP_LVDS9_N  [project net BP_IO.BP_LVDS9_N]
BP_LVDS9_P: R24.1 ; port BP_IO.BP_LVDS9_P  [project net BP_IO.BP_LVDS9_P]
BP_LVDS10_N: R27.1 ; port BP_IO.BP_LVDS10_N  [project net BP_IO.BP_LVDS10_N]
BP_LVDS10_P: R26.1 ; port BP_IO.BP_LVDS10_P  [project net BP_IO.BP_LVDS10_P]
BP_LVDS11_N: R29.1 ; port BP_IO.BP_LVDS11_N  [project net BP_IO.BP_LVDS11_N]
BP_LVDS11_P: R28.1 ; port BP_IO.BP_LVDS11_P  [project net BP_IO.BP_LVDS11_P]
BP_LVDS12_N: R31.1 ; port BP_IO.BP_LVDS12_N  [project net BP_IO.BP_LVDS12_N]
BP_LVDS12_P: R30.1 ; port BP_IO.BP_LVDS12_P  [project net BP_IO.BP_LVDS12_P]
BP_LVDS13_N: R33.1 ; port BP_IO.BP_LVDS13_N  [project net BP_IO.BP_LVDS13_N]
BP_LVDS13_P: R32.1 ; port BP_IO.BP_LVDS13_P  [project net BP_IO.BP_LVDS13_P]
BP_LVDS14_N: R35.1 ; port BP_IO.BP_LVDS14_N  [project net BP_IO.BP_LVDS14_N]
BP_LVDS14_P: R34.1 ; port BP_IO.BP_LVDS14_P  [project net BP_IO.BP_LVDS14_P]
BP_LVDS15_N: R37.1 ; port BP_IO.BP_LVDS15_N  [project net BP_IO.BP_LVDS15_N]
BP_LVDS15_P: R36.1 ; port BP_IO.BP_LVDS15_P  [project net BP_IO.BP_LVDS15_P]
I2C1_SCL: IC1.9(Z) IC1.10(Z) J14.27 ; port EEM1_I2C.SCL  [project net EEM1_I2C.SCL]
I2C1_SDA: IC1.2(Z) IC1.3(Z) J14.26 ; port EEM1_I2C.SDA  [project net EEM1_I2C.SDA]
I2C2_SCL: J24.27 ; port EEM2_I2C.SCL  [project net EEM2_I2C.SCL]
I2C2_SDA: J24.26 ; port EEM2_I2C.SDA  [project net EEM2_I2C.SDA]
LVDS0_N: J14.3 R65.2 ; port LVDS_IO.LVDS0_N
LVDS0_P: J14.2 R64.2 ; port LVDS_IO.LVDS0_P
LVDS1_N: J14.6 R67.2 ; port LVDS_IO.LVDS1_N
LVDS1_P: J14.5 R66.2 ; port LVDS_IO.LVDS1_P
LVDS2_N: J14.9 R11.2 ; port LVDS_IO.LVDS2_N
LVDS2_P: J14.8 R10.2 ; port LVDS_IO.LVDS2_P
LVDS3_N: J14.12 R13.2 ; port LVDS_IO.LVDS3_N
LVDS3_P: J14.11 R12.2 ; port LVDS_IO.LVDS3_P
LVDS4_N: J14.15 R15.2 ; port LVDS_IO.LVDS4_N
LVDS4_P: J14.14 R14.2 ; port LVDS_IO.LVDS4_P
LVDS5_N: J14.18 R17.2 ; port LVDS_IO.LVDS5_N
LVDS5_P: J14.17 R16.2 ; port LVDS_IO.LVDS5_P
LVDS6_N: J14.21 R19.2 ; port LVDS_IO.LVDS6_N
LVDS6_P: J14.20 R18.2 ; port LVDS_IO.LVDS6_P
LVDS7_N: J14.24 R21.2 ; port LVDS_IO.LVDS7_N
LVDS7_P: J14.23 R20.2 ; port LVDS_IO.LVDS7_P
LVDS8_N: J24.3 R23.2 ; port LVDS_IO.LVDS8_N
LVDS8_P: J24.2 R22.2 ; port LVDS_IO.LVDS8_P
LVDS9_N: J24.6 R25.2 ; port LVDS_IO.LVDS9_N
LVDS9_P: J24.5 R24.2 ; port LVDS_IO.LVDS9_P
LVDS10_N: J24.9 R27.2 ; port LVDS_IO.LVDS10_N
LVDS10_P: J24.8 R26.2 ; port LVDS_IO.LVDS10_P
LVDS11_N: J24.12 R29.2 ; port LVDS_IO.LVDS11_N
LVDS11_P: J24.11 R28.2 ; port LVDS_IO.LVDS11_P
LVDS12_N: J24.15 R31.2 ; port LVDS_IO.LVDS12_N
LVDS12_P: J24.14 R30.2 ; port LVDS_IO.LVDS12_P
LVDS13_N: J24.18 R33.2 ; port LVDS_IO.LVDS13_N
LVDS13_P: J24.17 R32.2 ; port LVDS_IO.LVDS13_P
LVDS14_N: J24.21 R35.2 ; port LVDS_IO.LVDS14_N
LVDS14_P: J24.20 R34.2 ; port LVDS_IO.LVDS14_P
LVDS15_N: J24.24 R37.2 ; port LVDS_IO.LVDS15_N
LVDS15_P: J24.23 R36.2 ; port LVDS_IO.LVDS15_P
SERVMOD_3V3: IC1.5(E) IC1.6(E) IC1.12(E) IC1.13(E) ; port SERVMOD_3V3

### Buses and harness runs
harness BP_I2C = port BP_I2C
harness BP_IO = port BP_IO
harness EEM1_I2C = port EEM1_I2C
harness EEM2_I2C = port EEM2_I2C
harness LVDS_IO = port LVDS_IO

### Layout directives
net class EEM_LVDS: LVDS0_N, LVDS0_P, LVDS1_N, LVDS1_P, LVDS2_N, LVDS2_P, LVDS3_N, LVDS3_P, LVDS4_N, LVDS4_P, LVDS5_N, LVDS5_P, LVDS6_N, LVDS6_P, LVDS7_N, LVDS7_P, LVDS8_N, LVDS8_P, LVDS9_N, LVDS9_P, LVDS10_N, LVDS10_P, LVDS11_N, LVDS11_P, LVDS12_N, LVDS12_P, LVDS13_N, LVDS13_P, LVDS14_N, LVDS14_P, LVDS15_N, LVDS15_P, LVDS_IO
net class BP_LVDS: BP_IO, BP_LVDS0_N, BP_LVDS0_P, BP_LVDS1_N, BP_LVDS1_P, BP_LVDS2_N, BP_LVDS2_P, BP_LVDS3_N, BP_LVDS3_P, BP_LVDS4_N, BP_LVDS4_P, BP_LVDS5_N, BP_LVDS5_P, BP_LVDS6_N, BP_LVDS6_P, BP_LVDS7_N, BP_LVDS7_P, BP_LVDS8_N, BP_LVDS8_P, BP_LVDS9_N, BP_LVDS9_P, BP_LVDS10_N, BP_LVDS10_P, BP_LVDS11_N, BP_LVDS11_P, BP_LVDS12_N, BP_LVDS12_P, BP_LVDS13_N, BP_LVDS13_P, BP_LVDS14_N, BP_LVDS14_P, BP_LVDS15_N, BP_LVDS15_P

### Notes on the sheet
- Project/Equipment
- Document
- Designer
- Drawn by
- Check.by
- Copyright WUT ISE 2024.
  This documentation describes Open Hardware and is licensed under the CERN OHL v.2. You may redistribute and modify this documentation under the terms of the CERN OHL v.2. (http://ohwr.org/CERNOHL). This documentation is distributed WITHOUT ANY EXPRESS OR IMPLIED WARRANTY, INCLUDING OF MERCHANTABILITY, SATISFACTORY QUALITY AND FITNESS FOR A PARTICULAR PURPOSE. Please see the CERN OHL v.2 for applicable conditions.
- Contact
- File
- Last Mod.
- Print Date
- Sheet
- Size
- A3
- of
- Rev

### Library data of the parts
C4 = CC0603_100NF_50V_10%_X7R: Non-polarised capacitor; Part Description: SMD Multilayer Chip Ceramic Capacitor; Manufacturer: GENERIC; Manufacturer1 Part Number: 223858615649; Voltage: 50V; TC: X7R; Tolerance: ±10%; Part Number: CC0603_100NF_50V_10%_X7R; Component Kind: Standard; Component Type: Standard; Pin Count: 2; Value: 100nF; Status: Preferred; Manufacturer Part Number: CC0603_100NF_50V_10%_X7R; Case: 0603; Mounted: Yes; Socket: No; SMD: Yes; Sense: No; Manufacturer1 Example: PHYCOMP; Manufacturer1 ComponentHeight: 0.87mm; HelpURL: \\cern.ch\dfs\Applications\Altium\Datasheets\CC0603_X7R_PHYCOMP.pdf; Author: CERN DEM JLC; CreateDate: 03.12.2007; LatestRevisionDate: 03.12.2007
IC1 = 74HC4066PW: Part Description: Quad Single-Pole Single-Throw Analog Switch; Manufacturer: NXP SEMICONDUCTORS; PressFit: No; Bonding: No; Part Number: 74HC4066PW; Component Kind: Standard; Component Type: Standard; Device: 74HC4066PW; PackageDescription: SOP, 0.65mm Pitch; 14 Pin, 4.40mm W X 5.00mm L X 1.20mm H body, IPC Medium Density; Manufacturer Part Number: 74HC4066PW; Pin Count: 14; Case: TSSOP14; Mounted: Yes; Socket: No; SMD: Yes; Sense: No; ComponentHeight: 1.1mm; Author: CERN DEM JLC; HelpURL: \\cern.ch\dfs\Applications\Altium\Datasheets\74HC4066PW.pdf; CreateDate: 19.11.2014; LatestRevisionDate: 19.11.2014
J14 J24 = 3M_N2530-6002RB: Connector 30 Male; Part Description: 30 Contacts - Straight .100'' x .100'' Low Profile Four-Wall Header, 2500 Series; Manufacturer: 3M; PressFit: No; Part Number: 3M_N2530-6002RB; Component Kind: Standard; Component Type: Standard; Pin Count: 30; Family: Header 30; Mounted: Yes; Socket: No; SMD: No; Sense: No; Status: None; Manufacturer Part Number: N2530-6002RB; ComponentHeight: 10.03mm; HelpURL: \\cern.ch\dfs\Applications\Altium\Datasheets\3M_N2530-6002RB.pdf; Author: CERN DEM JLC; CreateDate: 11.02.2009; LatestRevisionDate: 11.08.2009
R10-R37 R64-R67 = R0402_0R_JUMPER: as R53 on sheet CPCIS_Connectors; Part Number: R0402_0R_JUMPER; Component Kind: Standard; Component Type: Standard; Footprint: RESC1005X40N; Pin Count: 2; Value: 0; Status: Not recommended; Manufacturer Part Number: R0402_0R_JUMPER; Case: 0402; Mounted: Yes; Sense: No; Socket: No; SMD: Yes; Manufacturer1 Example: YAGEO PHYCOMP; Manufacturer1 ComponentHeight: 0.4mm; HelpURL: \\cern.ch\dfs\Applications\Altium\Datasheets\R0402_Phycomp_RC0402.pdf; Author: CERN DEM JLC; CreateDate: 03.12.2007; LatestRevisionDate: 17.10.2012